# EasyEDA Pro project Elektrotechnika.eprj

# Schematic Schematic1
Board Name: Board1; Create Date: 2026-01-05; Page Name: P1; Project Name: Elektrotechnika; Schematic Name: Schematic1; Update Date: 2026-01-05; Company: EasyEDA.com; Page Size: A4; Version: V1.0
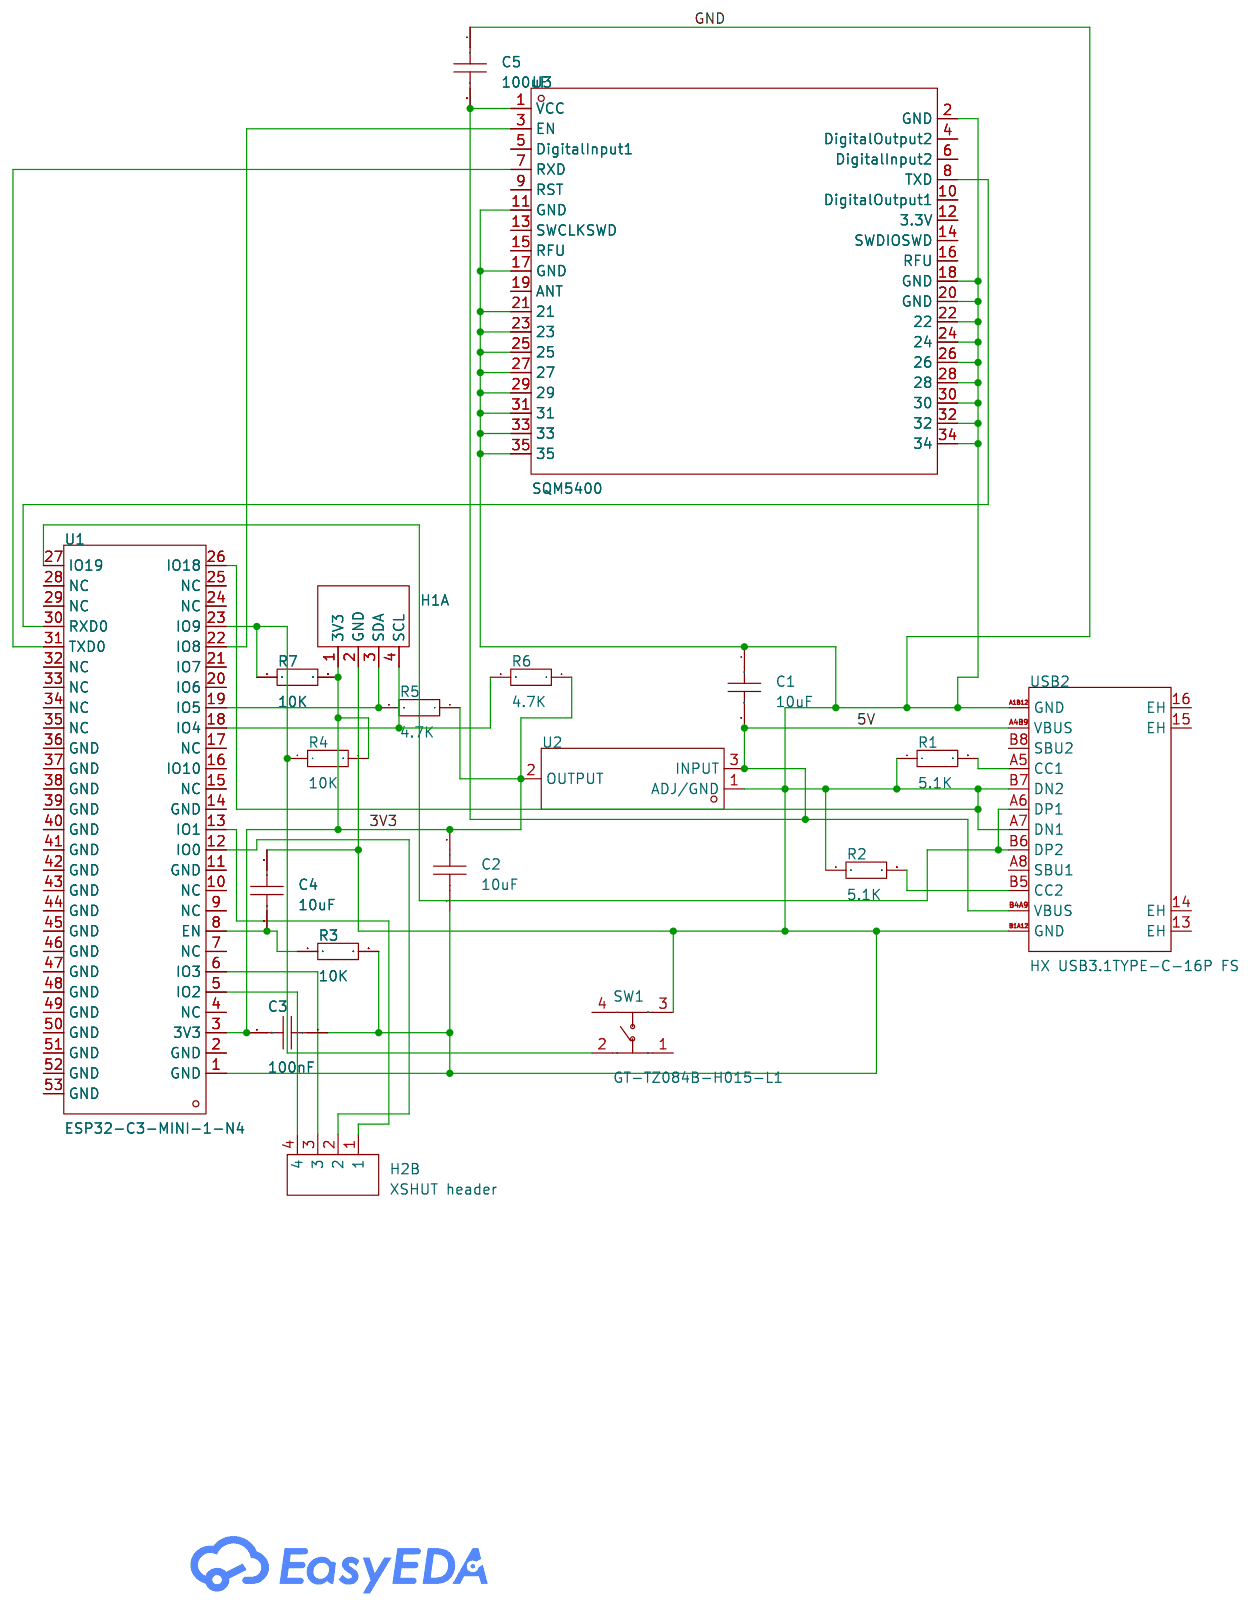
[diagram p0: schematic sheet]

## Parts
C1  10uF  [C0603]
C2  10uF  [C0603]
C3  100nF  [C0603]
C4  10uF  [C0603]
C5  100uF  [C0603]
H1  HX PH254-01-04-Z-L11.5 straight pin header  [HDR-TH_4P-HX-PH254-01-04-Z-L11.5]  (section 1)
H2  XSHUT header  [HDR-TH_4P-HX-PH254-01-04-Z-L11.5]  (section 2)
R1  5.1K  [R0603]
R2  5.1K  [R0603]
R3  10K  [R0603]
R4  10K  [R0603]
R5  4.7K  [R0603]
R6  4.7K  [R0603]
R7  10K  [R0603]
SW1  GT-TZ084B-H015-L1  [SW-SMD_4P-L5.2-W5.2-P3.70-LS6.4]
U1  ESP32-C3-MINI-1-N4  [WIFIM-SMD_ESP32-C3-MINI-1]
U2  AMS1117-3.3  [TO-252-2_L6.6-W5.6-P2.3-LS9.7]
U3  SQM5400  [COMM-SMD_35P-L21.0-W21.0_SQM5400]
USB2  HX USB3.1TYPE-C-16P FS  [USB-C-SMD_HX-USB3.1TYPE-C-16P-FS]

## Library data of the parts
C1-C5 = CAP_0603: Supplier Footprint: 0603
H1 = HX PH254-01-04-Z-L11.5 straight pin header: Pin Structure:1x4P Pitch:2.54mm Circluar Pins/Square Pins:Pin Header Mounting Type:Through Hole Number of Rows:1 Number of Pins:4P Current Rating:3A Voltage Rating (Max):1kV Length of Mating Pin:6mm Insulation Height:2.5mm Length of End Connection Pin:3mm; LCSC Part Name: 1x4P 间距:2.54mm 方针 直插; Supplier Part: F; Manufacturer: hanxia(韩下); Supplier Footprint: 插件,P=2.54mm; JLCPCB Part Class: Extended Part; Datasheet: https://item.szlcsc.com/datasheet/HX%2520PH254-01-04-Z-L11.5%2520straight%2520pin%2520header/54760437.html; Supplier: LCSC; Pin Structure: 1x4P; Pitch: 2.54mm; Circluar Pins/Square Pins: Pin Header; Mounting Type: Through Hole; Number of Rows: 1; Number of Pins: 4P; Current Rating: 3A; Voltage Rating (Max): 1kV; Length of Mating Pin: 6mm; Insulation Height: 2.5mm; Length of End Connection Pin: 3mm; Contact Material: Brass; Contact Plating: Gold; Operating Temperature: -40℃~+105℃
H2 = HX PH254-01-04-Z-L11.5 straight pin header: Pin Structure:1x4P Pitch:2.54mm Circluar Pins/Square Pins:Pin Header Mounting Type:Through Hole Number of Rows:1 Number of Pins:4P Current Rating:3A Voltage Rating (Max):1kV Length of Mating Pin:6mm Insulation Height:2.5mm Length of End Connection Pin:3mm; LCSC Part Name: 1x4P 间距:2.54mm 方针 直插; Supplier Part: C52016392; Manufacturer: hanxia(韩下); Supplier Footprint: 插件,P=2.54mm; JLCPCB Part Class: Extended Part; Datasheet: https://item.szlcsc.com/datasheet/HX%2520PH254-01-04-Z-L11.5%2520straight%2520pin%2520header/54760437.html; Supplier: LCSC; Pin Structure: 1x4P; Pitch: 2.54mm; Circluar Pins/Square Pins: Pin Header; Mounting Type: Through Hole; Number of Rows: 1; Number of Pins: 4P; Current Rating: 3A; Voltage Rating (Max): 1kV; Length of Mating Pin: 6mm; Insulation Height: 2.5mm; Length of End Connection Pin: 3mm; Contact Material: Brass; Contact Plating: Gold; Operating Temperature: -40℃~+105℃
R1-R7 = Res_0603: Supplier Footprint: 0603
SW1 = GT-TZ084B-H015-L1: LCSC Part Name: 4*4*1.5轻触开关; Supplier Part: C29780122; Manufacturer: G-Switch(品赞); Supplier Footprint: SMD-4P,5.2x5.2mm; JLCPCB Part Class: Extended Part; Datasheet: https://atta.szlcsc.com/upload/public/pdf/source/20240719/4891376090490F3A11AE408FF5E5C5E3.pdf; Supplier: LCSC; Circuit: SPST; Operating Force: 250gf; Switch Length: 5.2mm; Switch Width: 5.2mm; Switch Height: 1.5mm; Strike Gundam: Without; Contact Current: 50mA; Voltage Rating (DC): 12V; Insulation Resistance: 100mΩ; Actuator/Cap Color: Black; Operating Temperature: -40℃~+85℃
U1 = ESP32-C3-MINI-1-N4: LCSC Part Name: 支持2.4GHz Wi-Fi和蓝牙5的小尺寸模组; Supplier Part: C2838502; Manufacturer: ESPRESSIF(乐鑫); Supplier Footprint: SMD,16.6x13.2mm; JLCPCB Part Class: Extended Part; Datasheet: https://item.szlcsc.com/datasheet/ESP32-C3-MINI-1-N4/3013227.html; Supplier: LCSC; Model: Transceiver; Output Power(Max): 20.5dBm; Interface Type: SPI；UART；I2S；I2C；USB; Voltage - Supply: 3V~3.6V; Antenna Type: On-board PCB Antenna; Receive  Current: 84mA; Send  Current: 350mA; Sensitivity: -98dBm; Operating Temperature: -40℃~+85℃
U2 = AMS1117-3.3_C41414107: Supplier Part: C41414107; Manufacturer: YONGYUTAI(永裕泰); Supplier Footprint: TO-252; JLCPCB Part Class: Extended Part; Datasheet: https://item.szlcsc.com/datasheet/AMS1117-3.3/43231650.html; Supplier: LCSC; Output Type: Fixed; Voltage - Supply: 15V; Output Voltage: 3.3V; Output Current: 800mA; Power Supply Rejection Ratio (PSRR): 75dB@(120Hz); Voltage Dropout: 1.25V@(1A); Noise: 0.003%Vout; Features: Over Current Protection；Over Temperature Protection; Operating Temperature: -40℃~+125℃@(TJ); Output Configuration: Positive; Number of Outputs: 1
U3 = SQM5400: Supplier Part: C7383542; Manufacturer: SILION(芯联创展); JLCPCB Part Class: Extended Part; Datasheet: https://item.szlcsc.com/datasheet/SQM5400/8354953.html; Supplier: LCSC
USB2 = HX USB3.1TYPE-C-16P FS: LCSC Part Name: 2件套 Type-C 母 卧贴; Supplier Part: C41427498; Manufacturer: hanxia(韩下); Supplier Footprint: SMD; JLCPCB Part Class: Extended Part; Datasheet: https://item.szlcsc.com/datasheet/HX%2520USB3.1TYPE-C-16P%2520FS/43275710.html; Supplier: LCSC; Connector Type: Type-C; Protocol Standard: USB 3.1; Gender: Female; Mounting Type: Surface Mount, Right Angle; Number of Contacts: 16P; Number of Ports: 1; Current Rating-Power: 5A; Voltage Rating: 20V; Connect-Disconnect Life: 10,000 Cycles; Length: 7.05mm; Detection color: Black; Operating Temperature: -30℃~+80℃

## Nets
3V3: C2.1 C3.2 H1.1(3V3) R4.2 R5.1 R6.1 R7.2 U1.3(3V3) U2.2(OUTPUT)
5V: C1.2 C5.2 U2.3(INPUT) U3.1(VCC) USB2.A4B9(VBUS) USB2.B4A9(VBUS)
GND: C1.1 C2.2 C3.1 C4.1 C5.1 H1.2(GND) R1.1 R2.1 R3.2 SW1.3 U1.1(GND) U1.26(IO18) U2.1(ADJ/GND) U3.2(GND) U3.11(GND) U3.17(GND) U3.18(GND) U3.20(GND) U3.21 U3.22 U3.23 U3.24 U3.25 U3.26 U3.27 U3.28 U3.29 U3.30 U3.31 U3.32 U3.33 U3.34 U3.35 USB2.A1B12(GND) USB2.A7(DN1) USB2.B1A12(GND) USB2.B7(DN2)
$1N2082: U1.30(RXD0) U3.8(TXD)
$1N2093: U1.31(TXD0) U3.7(RXD)
$1N2100: U1.22(IO8) U3.3(EN)
$1N3585: U1.27(IO19) USB2.A6(DP1) USB2.B6(DP2)
$1N3868: R1.2 USB2.A5(CC1)
$1N4128: R2.2 USB2.B5(CC2)
$1N4276: C4.2 R3.1 U1.8(EN)
$1N4673: R4.1 R7.1 SW1.2 U1.23(IO9)
$1N5080: H1.4(SCL) R6.2 U1.18(IO4)
$1N5085: H1.3(SDA) R5.2 U1.19(IO5)
$1N5495: H2.4 U1.5(IO2)
$1N5500: H2.3 U1.6(IO3)
$1N5634: H2.2 U1.12(IO0)
$1N6706: H2.1 U1.13(IO1)

Not connected (* = marked no-connect by the designer): SW1 1 4; U1 2(GND) 4(NC) 7(NC) 9(NC) 10(NC) 11(GND) 14(GND) 15(NC) 16(IO10) 17(NC) 20(IO6) 21(IO7) 24(NC) 25(NC) 28(NC) 29(NC) 32(NC) 33(NC) 34(NC) 35(NC) 36(GND) 37(GND) 38(GND) 39(GND) 40(GND) 41(GND) 42(GND) 43(GND) 44(GND) 45(GND) 46(GND) 47(GND) 48(GND) 49(GND) 50(GND) 51(GND) 52(GND) 53(GND); U3 4(DigitalOutput2) 5(DigitalInput1) 6(DigitalInput2) 9(RST) 10(DigitalOutput1) 12(3.3V) 13(SWCLKSWD) 14(SWDIOSWD) 15(RFU) 16(RFU) 19(ANT); USB2 13(EH) 14(EH) 15(EH) 16(EH) A8(SBU1) B8(SBU2)

# Board PCB1
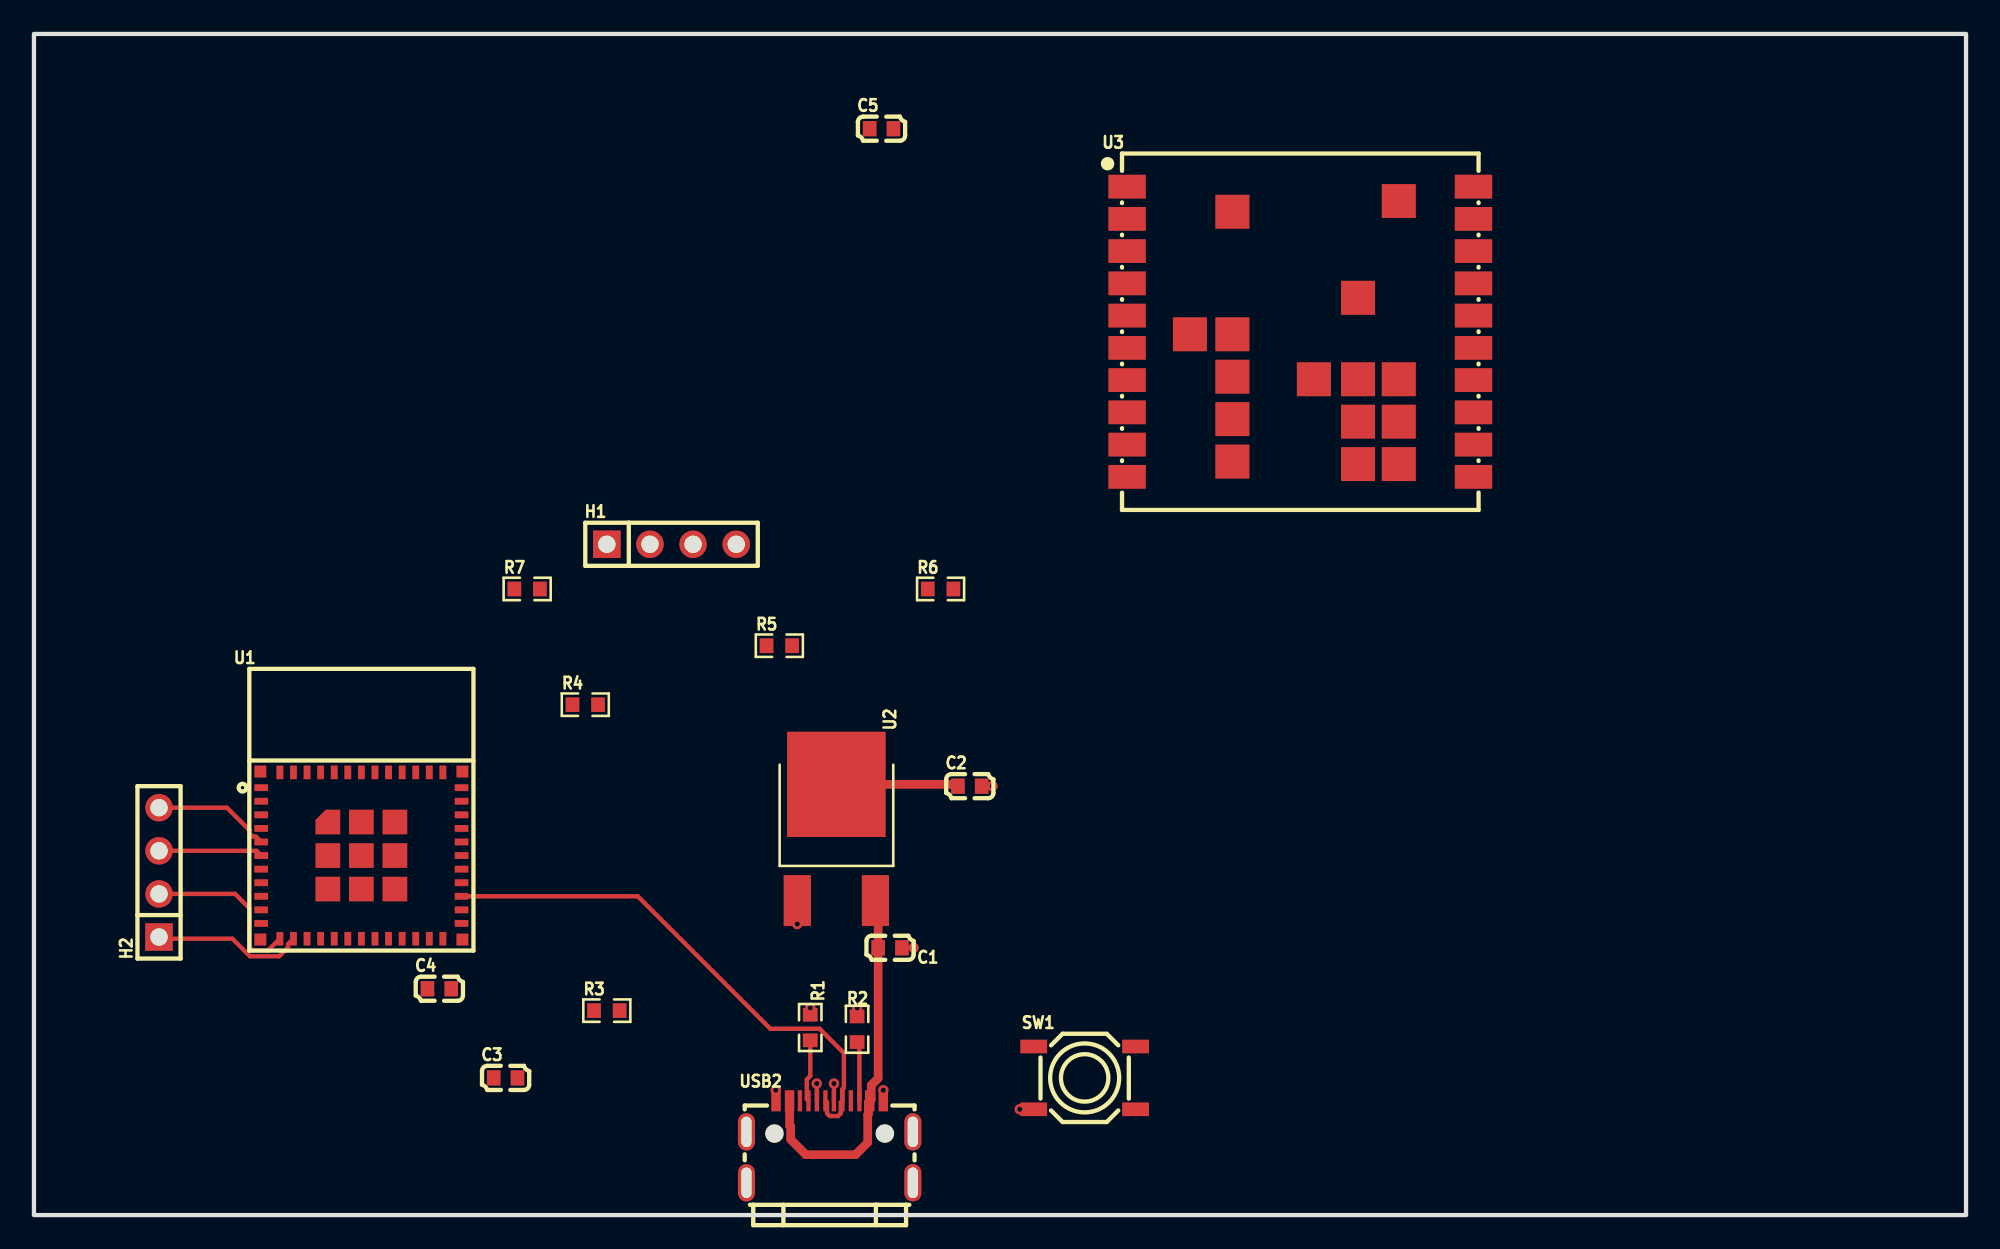
[diagram p1: board, top side]
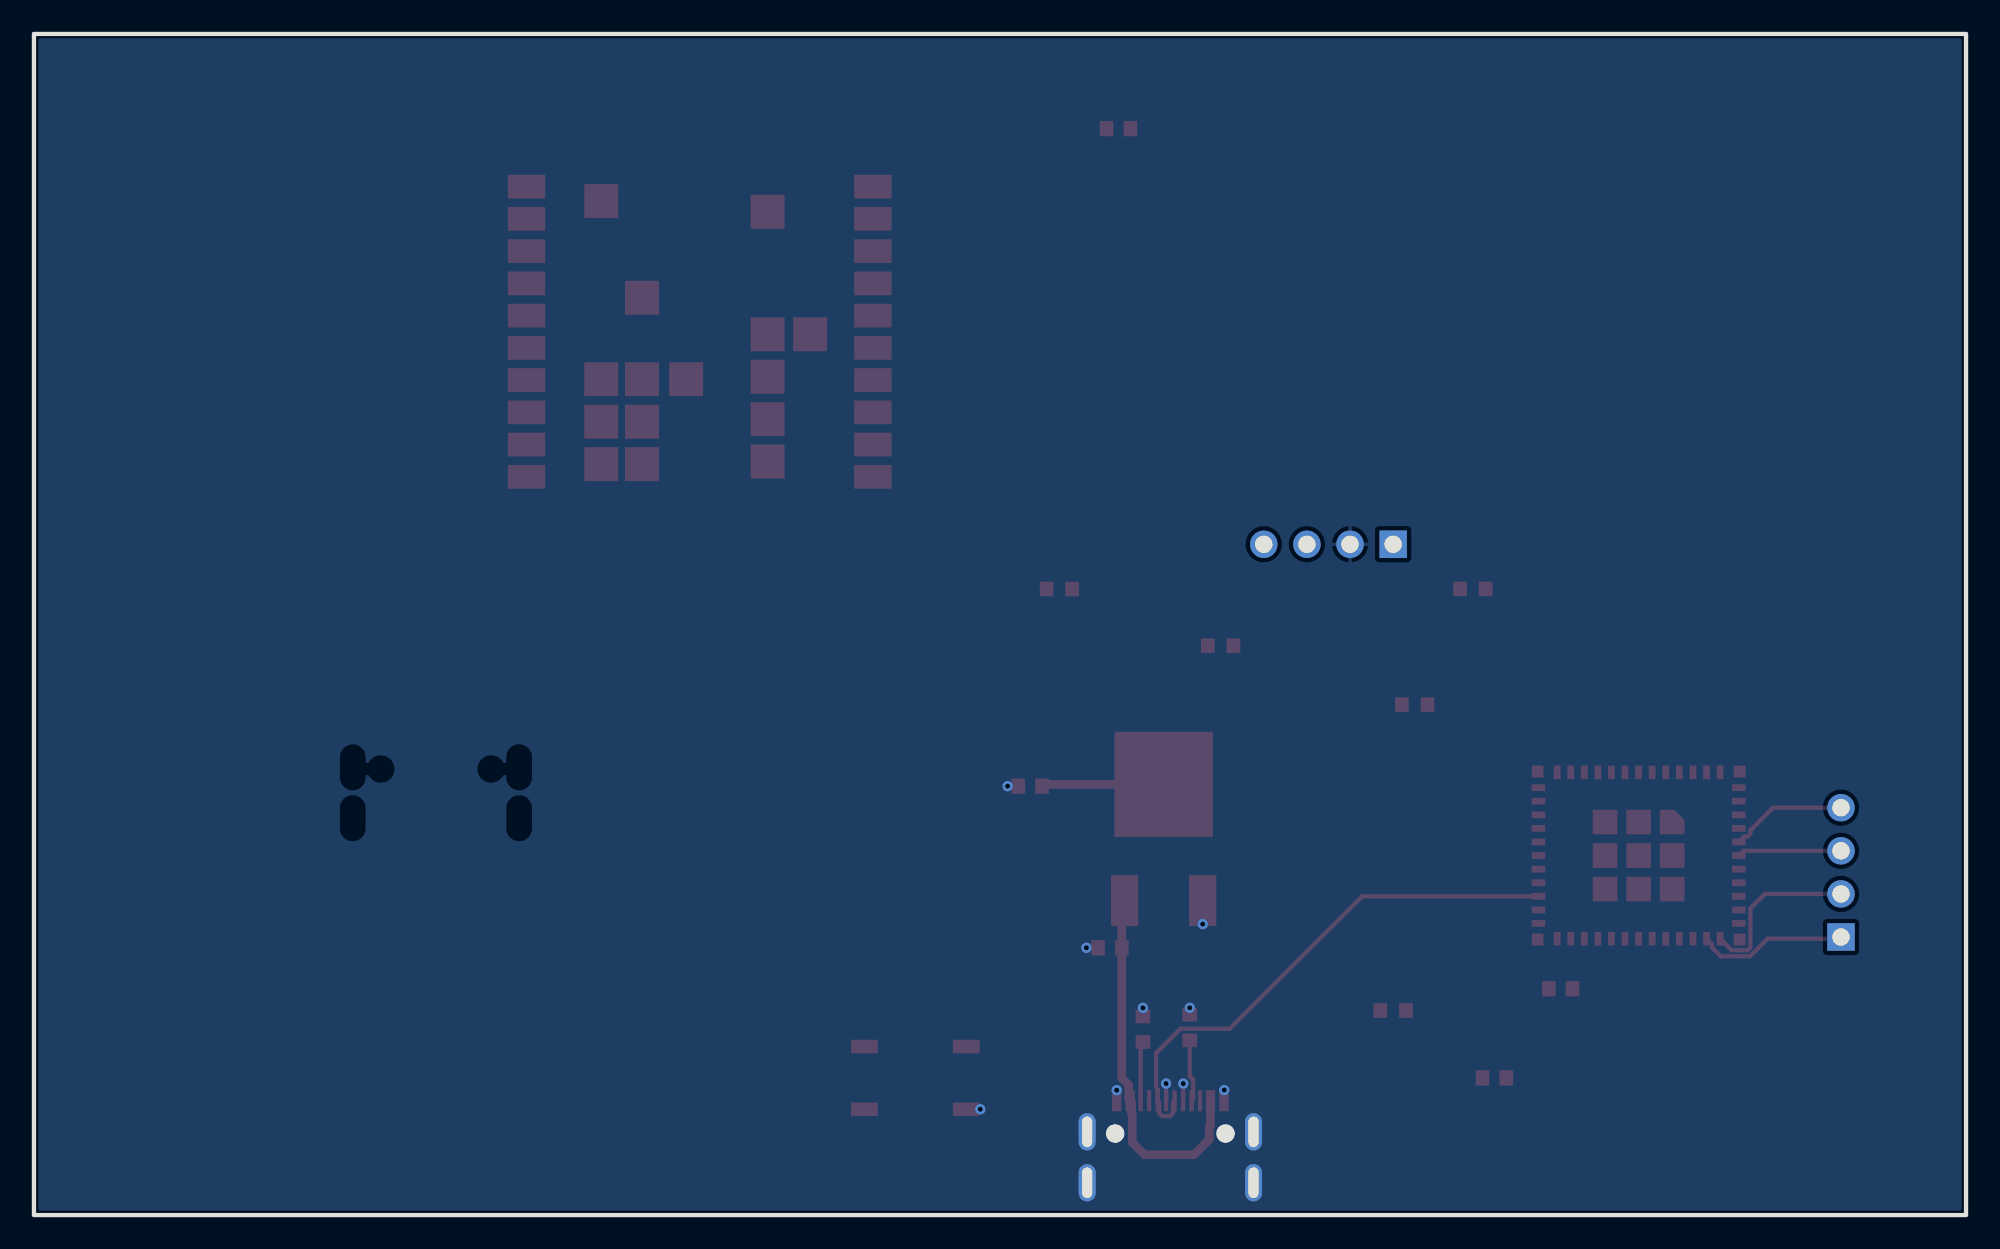
[diagram p2: board, bottom side, seen from below]

Outline 113.79 x 69.6 mm; copper layers: Top Layer, Bottom Layer. Coordinates in mm from the lower left corner of the outline.
Outline path: rectangle 0,69.6 113.79,0
Stack: Top Layer 0.035mm / Dielectric1 1.51mm FR4 er 4.5 / Bottom Layer 0.035mm

## Design rules (mm)
template: Custom Config
spacing copperThickness1oz (default): track to track 0.102, other pairs 0.152 to 0.3
spacing copperThickness2oz: track to track 0.203, other pairs 0.152 to 0.3
track width copperThickness1oz (default): min 0.127, default 0.254, max 2.54
track width copperThickness2oz: min 0.203, default 0.254, max 2.54
track width 3V3: min 0.127, default 0.508, max 2.54
track width 5V: min 0.127, default 0.508, max 2.54
differential pair differentialPair (default): width min 0.127, default 0.254, max 2.54; gap min 0.152, default 0.152
via viaSize (default): diameter min 0.5, default 0.61, max 10; hole min 0.3, default 0.305, max 6.3
net 5V uses 5V
net 3V3 uses 3V3

## Placement (name value [footprint] x y rotation side)
C1  10uF  [C0603]  50.42 15.75 180 top
C2  10uF  [C0603]  55.12 25.27 0 top
C3  100nF  [C0603]  27.78 8.08 0 top
C4  10uF  [C0603]  23.88 13.33 0 top
C5  100uF  [C0603]  49.92 64.01 0 top
H1  HX PH254-01-04-Z-L11.5 straight pin header  [HDR-TH_4P-HX-PH254-01-04-Z-L11.5]  37.55 39.52 0 top
H2  XSHUT header  [HDR-TH_4P-HX-PH254-01-04-Z-L11.5]  7.37 20.19 90 top
R1  5.1K  [R0603]  45.72 11.05 270 top
R2  5.1K  [R0603]  48.48 10.95 270 top
R3  10K  [R0603]  33.74 12.05 0 top
R4  10K  [R0603]  32.47 30.07 0 top
R5  4.7K  [R0603]  43.9 33.55 0 top
R6  4.7K  [R0603]  53.4 36.89 0 top
R7  10K  [R0603]  29.05 36.89 0 top
SW1  GT-TZ084B-H015-L1  [SW-SMD_4P-L5.2-W5.2-P3.70-LS6.4]  61.88 8.08 0 top
U1  ESP32-C3-MINI-1-N4  [WIFIM-SMD_ESP32-C3-MINI-1]  19.28 21.18 0 top
U2  AMS1117-3.3  [TO-252-2_L6.6-W5.6-P2.3-LS9.7]  47.26 21.95 270 top
U3  SQM5400  [COMM-SMD_35P-L21.0-W21.0_SQM5400]  74.58 52.05 0 top
USB2  HX USB3.1TYPE-C-16P FS  [USB-C-SMD_HX-USB3.1TYPE-C-16P-FS]  46.86 4.32 0 top

## Footprints (pads in the part's own frame, mm; a bottom-side part is the same pattern mirrored in y, then rotated)
C0603
  rect 0.8x0.9 smd: 1(-0.7,0) 2(0.7,0)
COMM-SMD_35P-L21.0-W21.0_SQM5400
  rect 2.2x1.4 smd: 1(-10.2,8.55) 2(-10.2,6.65) 3(-10.2,4.75) 4(-10.2,2.85) 5(-10.2,0.95) 6(-10.2,-0.95) 7(-10.2,-2.85) 8(-10.2,-4.75) 9(-10.2,-6.65) 10(-10.2,-8.55) 11(10.2,-8.55) 12(10.2,-6.65) 13(10.2,-4.75) 14(10.2,-2.85) 15(10.2,-0.95) 16(10.2,0.95) 17(10.2,2.85) 18(10.2,4.75) 19(10.2,6.65) 20(10.2,8.55)
  rect 2x2 smd: 21(-4,7.07) 22(-6.5,-0.15) 23(-4,-0.15) 24(-4,-2.65) 25(-4,-5.15) 26(-4,-7.65) 27(0.8,-2.8) 28(3.4,2) 29(3.4,-2.8) 30(3.4,-5.3) 31(3.4,-7.8) 32(5.8,7.7) 33(5.8,-2.8) 34(5.8,-5.3) 35(5.8,-7.8)
HDR-TH_4P-HX-PH254-01-04-Z-L11.5
  rect 1.62x1.62 hole 1.02: 1(-3.81,0)
  round 1.62 hole 1.02: 2(-1.27,0) 3(1.27,0) 4(3.81,0)
R0603
  rect 0.806x0.864 smd: 1(-0.753,0) 2(0.753,0)
SW-SMD_4P-L5.2-W5.2-P3.70-LS6.4
  rect 1.58x0.8 smd: 1(-3,1.85) 2(3,1.85) 3(-3,-1.85) 4(3,-1.85)
TO-252-2_L6.6-W5.6-P2.3-LS9.7
  rect 3x1.6 smd: 1(3.423,-2.3) 3(3.424,2.3)
  rect 6.2x5.8 smd: 2(-3.424,0)
USB-C-SMD_HX-USB3.1TYPE-C-16P-FS
  oval 1x2.2 hole 0.6x1.8: 13(-4.9,0.585) 14(-4.9,-2.415) 15(4.9,-2.415) 16(4.9,0.585)
  rect 0.55x1.24 smd: A1B12(-3.16,2.415) A4B9(-2.36,2.415) B1A12(3.16,2.415) B4A9(2.36,2.415)
  rect 0.25x1.24 smd: A5(-1.25,2.415) A6(-0.25,2.415) A7(0.25,2.415) A8(1.25,2.415) B5(1.75,2.415) B6(0.75,2.415) B7(-0.75,2.415) B8(-1.75,2.415)
WIFIM-SMD_ESP32-C3-MINI-1
  rect 0.8x0.4 smd: 1(-5.9,4) 2(-5.9,3.2) 3(-5.9,2.4) 4(-5.9,1.6) 5(-5.9,0.8) 6(-5.9,0) 7(-5.9,-0.8) 8(-5.9,-1.6) 9(-5.9,-2.4) 10(-5.9,-3.2) 11(-5.9,-4) 25(5.9,-4) 26(5.9,-3.2) 27(5.9,-2.4) 28(5.9,-1.6) 29(5.9,-0.8) 30(5.9,0) 31(5.9,0.8) 32(5.9,1.6) 33(5.9,2.4) 34(5.9,3.2) 35(5.9,4)
  rect 0.4x0.8 smd: 12(-4.8,-4.9) 13(-4,-4.9) 14(-3.2,-4.9) 15(-2.4,-4.9) 16(-1.6,-4.9) 17(-0.8,-4.9) 18(0,-4.9) 19(0.8,-4.9) 20(1.6,-4.9) 21(2.4,-4.9) 22(3.2,-4.9) 23(4,-4.9) 24(4.8,-4.9) 36(4.8,4.9) 37(4,4.9) 38(3.2,4.9) 39(2.4,4.9) 40(1.6,4.9) 41(0.8,4.9) 42(0,4.9) 43(-0.8,4.9) 44(-1.6,4.9) 45(-2.4,4.9) 46(-3.2,4.9) 47(-4,4.9) 48(-4.8,4.9)
  custom 1.45x1.45 smd: 49(-1.975,1.975)
  rect 1.45x1.45 smd: 49(-1.975,0) 49(-1.975,-1.975) 49(0,1.975) 49(0,0) 49(0,-1.975) 49(1.975,1.975) 49(1.975,0) 49(1.975,-1.975)
  rect 0.7x0.7 smd: 50(5.95,4.95) 51(5.95,-4.95) 52(-5.95,-4.95) 53(-5.95,4.95)

## Nets
As in the schematic.

Pads without a net: SW1 1 4; U1 2 4 7 9 10 11 14 15 16 17 20 21 24 25 28 29 32 33 34 35 36 37 38 39 40 41 42 43 44 45 46 47 48 49 50 51 52 53; U3 4 5 6 9 10 12 13 14 15 16 19; USB2 13 14 15 16 A8 B8

## Via types
v1: diameter 0.61, hole 0.305, Top Layer to Bottom Layer, 10 vias

## Routing (per net, layer and track width the routed paths; a pad name or vN(x,y) marks a point on that pad's centre or on a via; arc(x,y) is an arc through that point)
3V3: length 7.2
  Top Layer w0.508: C2.1 54.31,25.38 U2.2
5V: length 22.1
  Top Layer w0.508: 44.5,6.73 44.5,5.27 44.57,5.2 44.57,4.45 45.47,3.56 48.39,3.56 49.11,4.27 49.11,5.91 49.14,5.94 49.14,6.65 49.31,6.82 49.31,7.65 49.72,8.06 C1.2 49.72,18.37 U2.3
GND: length 2
  Top Layer w0.254: 46.11,6.73 46.11,7.73 v1(46.1,7.75) ; v1(47.12,7.75) 47.12,6.74 47.11,6.73
  vias: v1(43.69,7.37) v1(44.96,17.14) v1(45.72,12.21) v1(48.48,12.21) v1(50.02,7.36) v1(51.81,15.75) v1(56.45,25.27) v1(58.06,6.23)
$1N3585: length 31.7
  Top Layer w0.254: 46.61,6.73 46.71,6.64 46.71,6 46.87,5.83 47.35,5.83 47.52,6 47.52,6.64 47.61,6.73 47.61,7.42 47.7,7.5 47.7,9.54 46.27,10.98 43.37,10.98 35.56,18.78 U1.27
$1N3868: length 3.7
  Top Layer w0.254: 45.61,6.73 45.52,6.83 45.52,7.99 45.72,8.19 R1.2
$1N4128: length 3.5
  Top Layer w0.254: 48.61,6.73 48.61,10.06 48.48,10.2
$1N5495: length 7
  Top Layer w0.254: U1.5 13.06,22.3 12.87,22.3 12.7,22.47 12.7,22.66 11.36,24 H2.4
$1N5500: length 6.1
  Top Layer w0.254: U1.6 13.1,21.46 H2.3
$1N5634: length 10.1
  Top Layer w0.254: 7.37,18.92 11.84,18.92 12.7,18.06 12.7,15.77 12.87,15.6 13.8,15.6 14.48,16.28 U1.12
$1N6706: length 8.9
  Top Layer w0.254: H2.1 7.47,16.28 11.69,16.28 12.72,15.25 14.44,15.25 14.96,15.77 14.96,15.96 U1.13

## Copper pours and planes (outline as drawn; the poured copper is in the pictures)
GND on Bottom Layer: 0,69.6 113.79,69.6 113.79,0 0,0
